# Altium schematic sheet pca20020_sheet6_environment_sensors.SchDoc: PCA20020 - Environment Sensors
size A4; Organization: Nordic Semiconductor; DocumentNumber: 6; SheetNumber: 6; SheetTotal: 9; CompanyName: Nordic Semiconductor; DocumentSize: A4
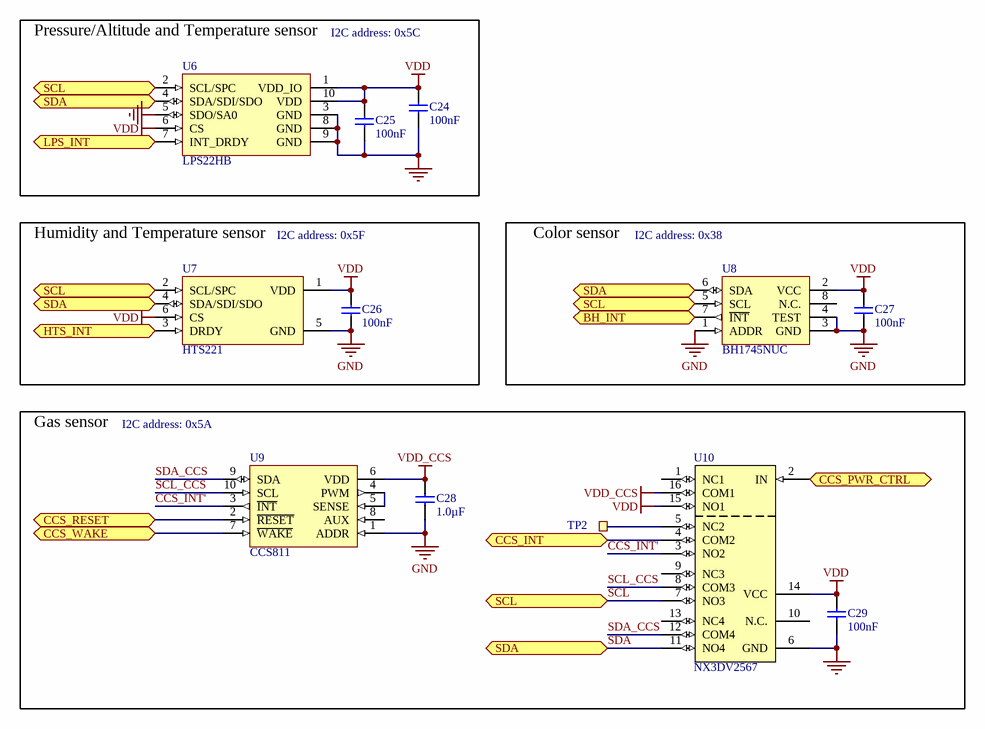
[diagram p0: pca20020_sheet6_environment_sensors.SchDoc]

## Parts
C24  100nF  [CAPC1005X04L]
C25  100nF  [CAPC1005X04L]
C26  100nF  [CAPC1005X04L]
C27  100nF  [CAPC1005X04L]
C28  1.0µF  [CAPC1005X04L]
C29  100nF  [CAPC1005X04L]
TP2  TP  [TESTPAD-TH]  (value not drawn)  (no BOM)
U6  LPS22HB  [LGA50P200X200X80-10N]
U7  HTS221  [HLGA100P200X200X100-6N]
U8  BH1745NUC  [WSON50P210X210X60_HS-9N]
U9  CCS811  [LGA60P270X400X110_HS-11N]
U10  NX3DV2567  [XQFN40P180X260X50-16N]

## Blocks framed on the sheet
Pressure/Altitude and Temperature sensor: C24 C25 U6
Humidity and Temperature sensor: C26 U7
Color sensor: C27 U8
Gas sensor: C28 C29 TP2 U9 U10

## Ports
BH_INT (bidir), CCS_INT (bidir), CCS_PWR_CTRL (bidir), CCS_RESET (bidir), CCS_WAKE (bidir), HTS_INT (bidir), LPS_INT (bidir), SCL (bidir), SDA (bidir)

## Nets
GND: C24.1 C25.1 C26.1 C27.1 C28.1 C29.1 U6.3(GND) U6.5(SDO/SA0) U6.8(GND) U6.9(GND) U7.5(GND) U8.1(ADDR) U8.3(GND) U8.4(TEST) U8.9(GND) U9.1(ADDR) U9.11(GND) U10.6(GND)
VDD: C24.2 C25.2 C26.2 C27.2 C29.2 U6.1(VDD_IO) U6.6(CS) U6.10(VDD) U7.1(VDD) U7.6(CS) U8.2(VCC) U10.14(VCC) U10.15(NO1)
VDD_CCS: C28.2 U9.6(VDD) U10.16(COM1)
BH_INT: U8.7(~{INT}) ; port BH_INT
CCS_INT: U10.4(COM2) ; port CCS_INT
CCS_INT': U9.3(~{INT}) U10.3(NO2)
CCS_PWR_CTRL: U10.2(IN) ; port CCS_PWR_CTRL
CCS_RESET: U9.2(~{RESET}) ; port CCS_RESET
CCS_WAKE: U9.7(~{WAKE}) ; port CCS_WAKE
HTS_INT: U7.3(DRDY) ; port HTS_INT
LPS_INT: U6.7(INT_DRDY) ; port LPS_INT
SCL: U6.2(SCL/SPC) U7.2(SCL/SPC) U8.5(SCL) U10.7(NO3) ; port SCL
SCL_CCS: U9.10(SCL) U10.8(COM3)
SDA: U6.4(SDA/SDI/SDO) U7.4(SDA/SDI/SDO) U8.6(SDA) U10.11(NO4) ; port SDA
SDA_CCS: U9.9(SDA) U10.12(COM4)
NetTP2_1: TP2.1 U10.5(NC2)
NetU9_4: U9.4(PWM) U9.5(SENSE)

Not connected (* = marked no-connect by the designer): U8 8(N.C.); U9 8(AUX); U10 1(NC1) 9(NC3) 10(N.C.) 13(NC4)

## Notes on the sheet
- I2C address: 0x5C
- I2C address: 0x5F
- (near U8) I2C address: 0x38
- (near U9) I2C address: 0x5A
- Title
- Size
- Date:
- A4
- Project Number
- Sheet         of
- Revision
- File:
- Drawn By:

## Library data of the parts
C24-C27 C29 = C0402-100n: Capacitor, X7R, ±10%; Part number IPS: 00000005296; Note: 16V; Artikkelnr Noca: 20039200; Part Number: C0402-100n; Manufacturer: *; Manufacturer Part Number: *; Footprint Doc: 0402; LatestRevisionDate: 2009-11-23; Pin Count: 2; Publisher: Nordic Semiconductor; Published: 2009-05-08; Value: 100nF; ComponentLink1URL: *; ComponentLink1Description: Datasheet; ComponentLink2URL: *; ComponentLink2Description: Supplier link; HelpURL: *; Supplier 1: *; Supplier Part Number 1: *; Supplier 2: *; Supplier Part Number 2: *
C28 = C0402-1µ0: Capacitor, X5R, ±5%, 6.3V; Part number IPS: 00000007786; Artikkelnr Noca: 20039235; Part Number: C0402-1µ0; Manufacturer: *; Manufacturer Part Number: *; Footprint Doc: 0402; LatestRevisionDate: 2016-08-22; Pin Count: 2; Publisher: Nordic Semiconductor; Published: 2009-05-08; Value: 1.0µF; Note: 6.3V; ComponentLink1URL: *; ComponentLink1Description: Datasheet; ComponentLink2URL: *; ComponentLink2Description: Supplier link; HelpURL: *; Supplier 1: Digi-Key; Supplier Part Number 1: 1276-1444-1-ND; Supplier 2: *; Supplier Part Number 2: *
TP2 = Testpoint TH: Testpoint, through hole; Artikkelnr Noca: N.A.; Part Number: Testpoint TH; Manufacturer: *; Manufacturer Part Number: *; Footprint Doc: TESTPAD-TH; LatestRevisionDate: 2009-12-12; Pin Count: 1; Publisher: Nordic Semiconductor; Published: 2009-12-12; Value: TP; Note: *; Part number IPS: N.A.; ComponentLink1URL: *; ComponentLink1Description: Datasheet; ComponentLink2URL: *; ComponentLink2Description: Supplier link; HelpURL: *; Supplier 1: *; Supplier Part Number 1: *; Supplier 2: *; Supplier Part Number 2: *
U6 = LPS22HB: MEMS nano pressure sensor: 260-1260 hPa absolute digital output barometer; Manufacturer: STMicroelectronics; Part number IPS: 00000007818; Artikkelnr Noca: N.A.; Part Number: LPS22HB; Manufacturer Part Number: LPS22HB; Footprint Doc: HLGA-10L; LatestRevisionDate: 2016-06-20; Pin Count: 10; Publisher: Nordic Semiconductor; Published: 2016-06-20; Value: LPS22HB; Note: *; ComponentLink1URL: *; ComponentLink1Description: Datasheet; ComponentLink2URL: *; ComponentLink2Description: Supplier link; HelpURL: http://www.st.com/content/ccc/resource/technical/document/datasheet/bf/c1/4f/23/61/17/44/8a/DM00140895.pdf/files/DM00140895.pdf/jcr:content/translations/en.DM00140895.pdf; Supplier 1: Digi-Key; Supplier Part Number 1: 497-16265-1-ND; Supplier 2: Mouser; Supplier Part Number 2: 511-LPS22HBTR
U7 = HTS221: Capacitive digital sensor for relative humidity and temperature; Manufacturer: STMicroelectronics; Part number IPS: 00000007819; Artikkelnr Noca: N.A.; Part Number: HTS221; Manufacturer Part Number: HTS221; Footprint Doc: HLGA-6L; LatestRevisionDate: 2016-09-15; Pin Count: 6; Publisher: Nordic Semiconductor; Published: 2016-09-15; Value: HTS221; Note: *; ComponentLink1URL: *; ComponentLink1Description: Datasheet; ComponentLink2URL: *; ComponentLink2Description: Supplier link; HelpURL: http://www.st.com/content/ccc/resource/technical/document/datasheet/4d/9a/9c/ad/25/07/42/34/DM00116291.pdf/files/DM00116291.pdf/jcr:content/translations/en.DM00116291.pdf; Supplier 1: Digi-Key; Supplier Part Number 1: 497-15382-1-ND; Supplier 2: Mouser; Supplier Part Number 2: 511-HTS221TR
U8 = BH1745NUC: Digital 16bit Serial Output Type Color Sensor IC; Manufacturer: Rohm Semiconductor; Part number IPS: 00000007820; Artikkelnr Noca: N.A.; Part Number: BH1745NUC; Manufacturer Part Number: BH1745NUC; Footprint Doc: WSON-8; LatestRevisionDate: 2015-10-07; Pin Count: 8; Publisher: Nordic Semiconductor; Published: 2015-10-07; Value: BH1745NUC; Note: *; ComponentLink1URL: *; ComponentLink1Description: Datasheet; ComponentLink2URL: *; ComponentLink2Description: Supplier link; HelpURL: http://rohmfs.rohm.com/en/products/databook/datasheet/ic/sensor/light/bh1745nuc-e.pdf; Supplier 1: Digi-Key; Supplier Part Number 1: BH1745NUC-E2CT-ND; Supplier 2: *; Supplier Part Number 2: *
U9 = CCS811: Ultra-low power digital gas sensor for monitoring indoor air quality; Manufacturer: Cambridge CMOS Sensors; Part number IPS: 00000007821; Artikkelnr Noca: N.A.; Part Number: CCS811; Manufacturer Part Number: CCS811; Footprint Doc: LGA-10; LatestRevisionDate: 2015-11-04; Pin Count: 10; Publisher: Nordic Semiconductor; Published: 2015-11-04; Value: CCS811; Note: *; ComponentLink1URL: *; ComponentLink1Description: Datasheet; ComponentLink2URL: *; ComponentLink2Description: Supplier link; HelpURL: *; Supplier 1: *; Supplier Part Number 1: *; Supplier 2: *; Supplier Part Number 2: *
U10 = NX3DV2567GU: Low-ohmic four-pole double-throw analog switch; Manufacturer: NXP Semiconductors; Part number IPS: 00000007816; Artikkelnr Noca: 15079317; Part Number: NX3DV2567GU; Manufacturer Part Number: NX3DV2567GU; Footprint Doc: XQFN-16; LatestRevisionDate: 2015-02-17; Pin Count: 16; Publisher: Nordic Semiconductor; Published: 2015-02-17; Value: NX3DV2567; Note: *; Supplier 1: Digi-Key; Supplier Part Number 1: 568-5206-1-ND; Supplier 2: Mouser; Supplier Part Number 2: 771-NX3DV2567GU115; ComponentLink1URL: *; ComponentLink1Description: Datasheet; ComponentLink2URL: *; ComponentLink2Description: Supplier link; HelpURL: http://www.nxp.com/documents/data_sheet/NX3DV2567.pdf